# Altium schematic sheet P11_Exp Conn, uSD, and .SchDoc
size Legal
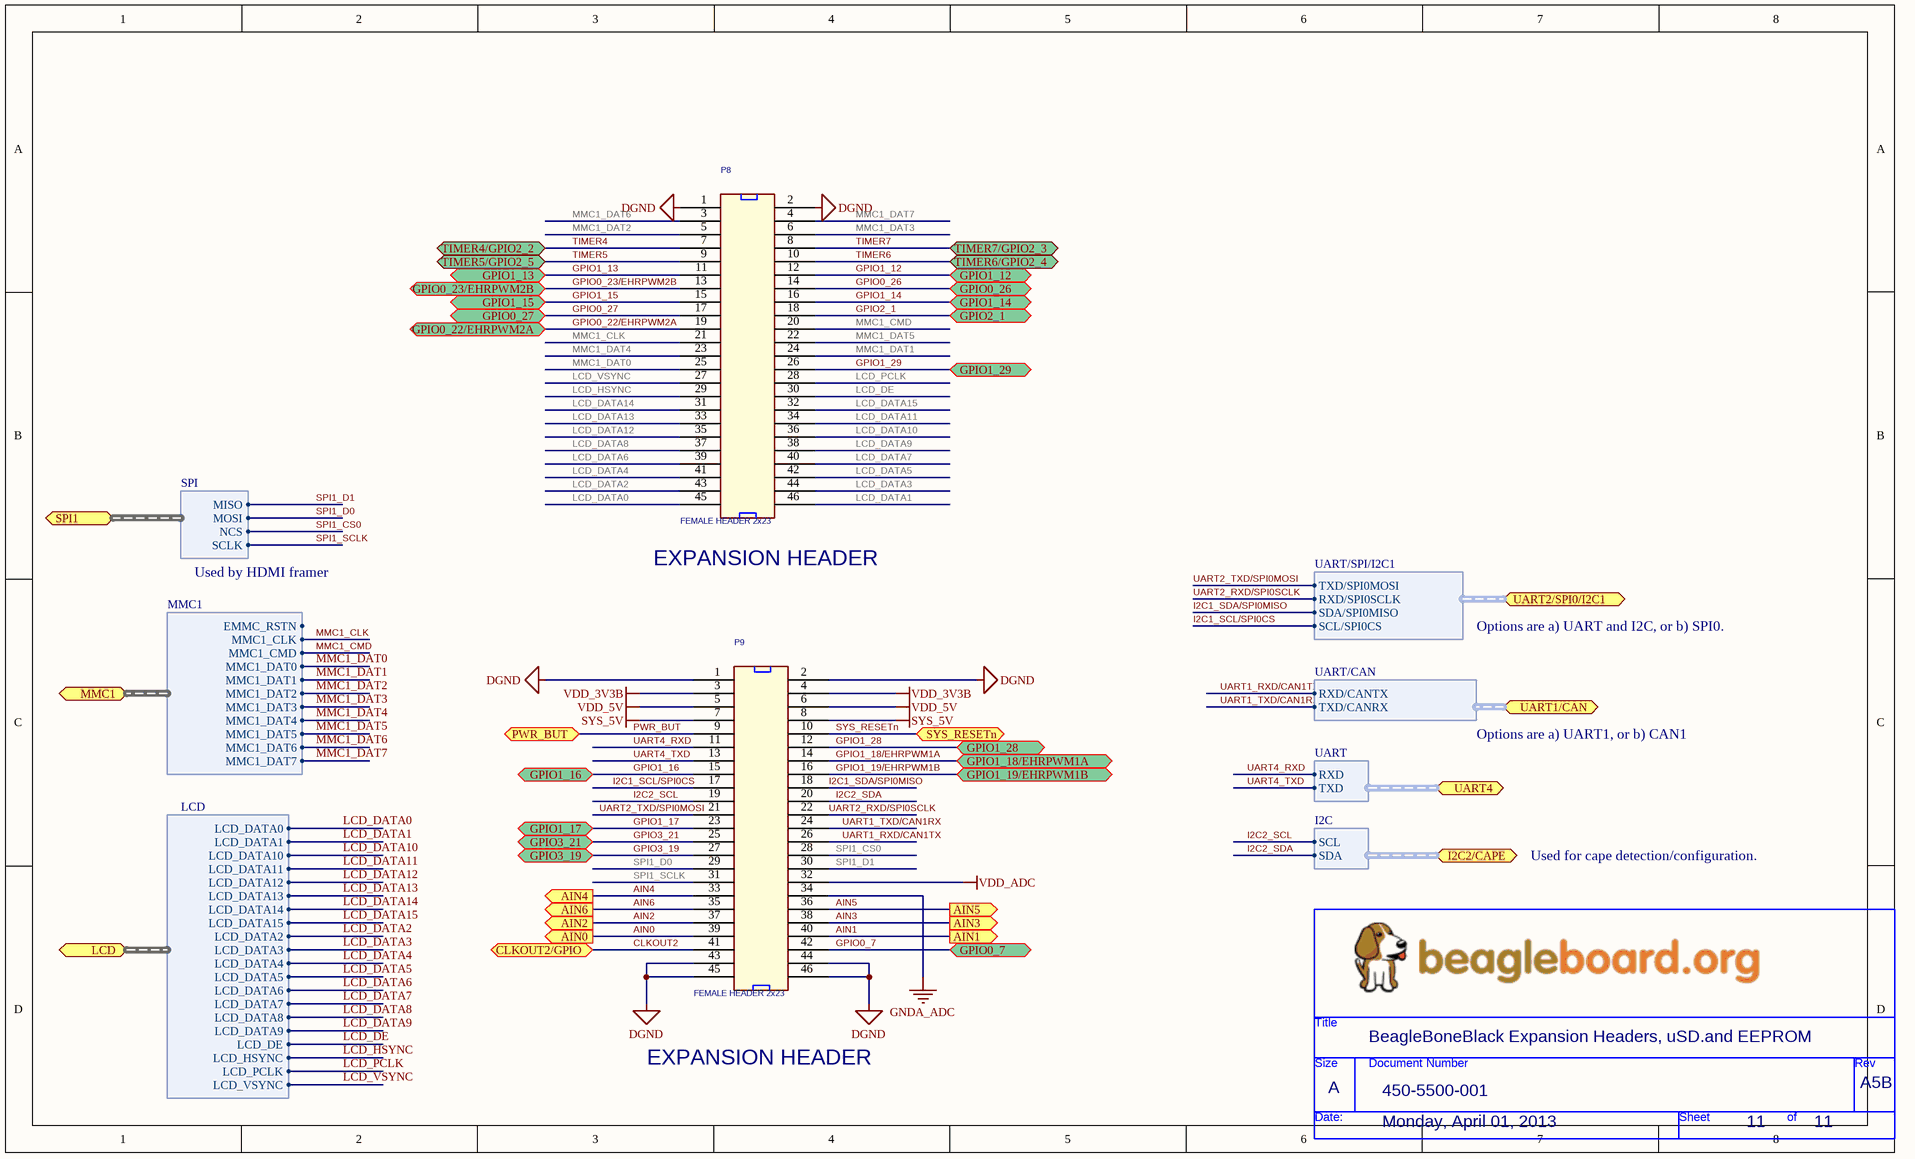
[diagram p0: P11_Exp Conn, uSD, and .SchDoc]

## Parts
*  Page Create Date: Monday, April 01, 2013  Doc: 450-5500-001  RevCode: A5B  Title: BeagleBoneBlack Expansion Headers, uSD.and EEPROM  Page Size: A  Page Number: 11  (hidden comment: BeagleBoard_org)  (graphical)
P8  FEMALE HEADER 2x23  [HEADER23X2]
P9  FEMALE HEADER 2x23  [HEADER23X2]

## Ports
AIN0 (out), AIN1 (out), AIN2 (out), AIN3 (out), AIN4 (out), AIN5 (out), AIN6 (out), CLKOUT2/GPIO, GPIO0_7, GPIO0_22/EHRPWM2A, GPIO0_23/EHRPWM2B, GPIO0_26, GPIO0_27, GPIO1_12, GPIO1_13, GPIO1_14, GPIO1_15, GPIO1_16, GPIO1_17, GPIO1_18/EHRPWM1A, GPIO1_19/EHRPWM1B, GPIO1_28, GPIO1_29, GPIO2_1, GPIO3_19, GPIO3_21, I2C2/CAPE (harness I2C), LCD (harness LCD), MMC1 (harness MMC1), PWR_BUT, SPI1 (harness SPI), SYS_RESETn, TIMER4/GPIO2_2 (bidir), TIMER5/GPIO2_5 (bidir), TIMER6/GPIO2_4 (bidir), TIMER7/GPIO2_3 (bidir), UART1/CAN (harness UART/CAN), UART2/SPI0/I2C1 (harness UART/SPI/I2C1), UART4 (harness UART)

## Harnesses
LCD: LCD_DATA0, LCD_DATA1, LCD_DATA10, LCD_DATA11, LCD_DATA12, LCD_DATA13, LCD_DATA14, LCD_DATA15, LCD_DATA2, LCD_DATA3, LCD_DATA4, LCD_DATA5, LCD_DATA6, LCD_DATA7, LCD_DATA8, LCD_DATA9, LCD_DE, LCD_HSYNC, LCD_PCLK, LCD_VSYNC
MMC1: EMMC_RSTN, MMC1_CLK, MMC1_CMD, MMC1_DAT0, MMC1_DAT1, MMC1_DAT2, MMC1_DAT3, MMC1_DAT4, MMC1_DAT5, MMC1_DAT6, MMC1_DAT7
UART: RXD, TXD
I2C: SCL, SDA
SPI: MISO, MOSI, NCS, SCLK
UART/CAN: RXD/CANTX, TXD/CANRX
UART/SPI/I2C1: RXD/SPI0SCLK, TXD/SPI0MOSI, SDA/SPI0MISO, SCL/SPI0CS

## Nets
DGND: P8.1 P8.2 P9.1 P9.2 P9.43 P9.44 P9.45 P9.46
GNDA_ADC: P9.34
SYS_5V: P9.7 P9.8
VDD_3V3B: P9.3 P9.4
VDD_5V: P9.5 P9.6
VDD_ADC: P9.32
AIN0: P9.39 ; port AIN0
AIN1: P9.40 ; port AIN1
AIN2: P9.37 ; port AIN2
AIN3: P9.38 ; port AIN3
AIN4: P9.33 ; port AIN4
AIN5: P9.36 ; port AIN5
AIN6: P9.35 ; port AIN6
CLKOUT2: P9.41 ; port CLKOUT2/GPIO
GPIO0_7: P9.42 ; port GPIO0_7
GPIO0_22/EHRPWM2A: P8.19 ; port GPIO0_22/EHRPWM2A
GPIO0_23/EHRPWM2B: P8.13 ; port GPIO0_23/EHRPWM2B
GPIO0_26: P8.14 ; port GPIO0_26
GPIO0_27: P8.17 ; port GPIO0_27
GPIO1_12: P8.12 ; port GPIO1_12
GPIO1_13: P8.11 ; port GPIO1_13
GPIO1_14: P8.16 ; port GPIO1_14
GPIO1_15: P8.15 ; port GPIO1_15
GPIO1_16: P9.15 ; port GPIO1_16
GPIO1_17: P9.23 ; port GPIO1_17
GPIO1_18/EHRPWM1A: P9.14 ; port GPIO1_18/EHRPWM1A
GPIO1_19/EHRPWM1B: P9.16 ; port GPIO1_19/EHRPWM1B
GPIO1_28: P9.12 ; port GPIO1_28
GPIO1_29: P8.26 ; port GPIO1_29
GPIO2_1: P8.18 ; port GPIO2_1
GPIO3_19: P9.27 ; port GPIO3_19
GPIO3_21: P9.25 ; port GPIO3_21
I2C1_SCL/SPI0CS: P9.17 ; port UART2/SPI0/I2C1.SCL/SPI0CS
I2C1_SDA/SPI0MISO: P9.18 ; port UART2/SPI0/I2C1.SDA/SPI0MISO
I2C2_SCL: P9.19 ; port I2C2/CAPE.SCL
I2C2_SDA: P9.20 ; port I2C2/CAPE.SDA
LCD_DATA0: P8.45 ; port LCD.LCD_DATA0
LCD_DATA1: P8.46 ; port LCD.LCD_DATA1
LCD_DATA2: P8.43 ; port LCD.LCD_DATA2
LCD_DATA3: P8.44 ; port LCD.LCD_DATA3
LCD_DATA4: P8.41 ; port LCD.LCD_DATA4
LCD_DATA5: P8.42 ; port LCD.LCD_DATA5
LCD_DATA6: P8.39 ; port LCD.LCD_DATA6
LCD_DATA7: P8.40 ; port LCD.LCD_DATA7
LCD_DATA8: P8.37 ; port LCD.LCD_DATA8
LCD_DATA9: P8.38 ; port LCD.LCD_DATA9
LCD_DATA10: P8.36 ; port LCD.LCD_DATA10
LCD_DATA11: P8.34 ; port LCD.LCD_DATA11
LCD_DATA12: P8.35 ; port LCD.LCD_DATA12
LCD_DATA13: P8.33 ; port LCD.LCD_DATA13
LCD_DATA14: P8.31 ; port LCD.LCD_DATA14
LCD_DATA15: P8.32 ; port LCD.LCD_DATA15
LCD_DE: P8.30 ; port LCD.LCD_DE
LCD_HSYNC: P8.29 ; port LCD.LCD_HSYNC
LCD_PCLK: P8.28 ; port LCD.LCD_PCLK
LCD_VSYNC: P8.27 ; port LCD.LCD_VSYNC
MMC1_CLK: P8.21 ; port MMC1.MMC1_CLK
MMC1_CMD: P8.20 ; port MMC1.MMC1_CMD
MMC1_DAT0: P8.25 ; port MMC1.MMC1_DAT0
MMC1_DAT1: P8.24 ; port MMC1.MMC1_DAT1
MMC1_DAT2: P8.5 ; port MMC1.MMC1_DAT2
MMC1_DAT3: P8.6 ; port MMC1.MMC1_DAT3
MMC1_DAT4: P8.23 ; port MMC1.MMC1_DAT4
MMC1_DAT5: P8.22 ; port MMC1.MMC1_DAT5
MMC1_DAT6: P8.3 ; port MMC1.MMC1_DAT6
MMC1_DAT7: P8.4 ; port MMC1.MMC1_DAT7
PWR_BUT: P9.9 ; port PWR_BUT
SPI1_CS0: P9.28 ; port SPI1.NCS
SPI1_D0: P9.29 ; port SPI1.MOSI
SPI1_D1: P9.30 ; port SPI1.MISO
SPI1_SCLK: P9.31 ; port SPI1.SCLK
SYS_RESETn: P9.10 ; port SYS_RESETn
TIMER4: P8.7 ; port TIMER4/GPIO2_2
TIMER5: P8.9 ; port TIMER5/GPIO2_5
TIMER6: P8.10 ; port TIMER6/GPIO2_4
TIMER7: P8.8 ; port TIMER7/GPIO2_3
UART1_RXD/CAN1TX: P9.26 ; port UART1/CAN.RXD/CANTX
UART1_TXD/CAN1RX: P9.24 ; port UART1/CAN.TXD/CANRX
UART2_RXD/SPI0SCLK: P9.22 ; port UART2/SPI0/I2C1.RXD/SPI0SCLK
UART2_TXD/SPI0MOSI: P9.21 ; port UART2/SPI0/I2C1.TXD/SPI0MOSI
UART4_RXD: P9.11 ; port UART4.RXD
UART4_TXD: P9.13 ; port UART4.TXD

## Notes on the sheet
- Used by HDMI framer
- (near P8) EXPANSION HEADER
- Options are a) UART and I2C, or b) SPI0.
- Options are a) UART1, or b) CAN1
- Used for cape detection/configuration.
- EXPANSION HEADER
- (in symbol BeagleBoard_org) Title; Size; Document Number; Rev; Date:; Sheet; of

## Library data of the parts
P8 P9 = HDR_46_F_2_0.1_0.1: CONN HEADER FMAL 46PS.1" DL GOLD; Manufacturer: Sullins Connector Solutions; Manufacturer Part Number: PPPC232LFBN-RC; Number of Positions: 46; Number of Positions Loaded: All; Pitch: 0.100" (2.54mm); Supplier 1: Digi-Key; Supplier Part Number 1: S7126-ND; RoHS: RoHS Compliant; Category: Connectors, Interconnects; Stock 1: 750; Pricing 1: 1=2.75, 10=2.325, 25=2.2196, 50=2.0084, 100=1.7969, 250=1.58552, 500=1.4798, 1000=1.3741, 2500=1.32125 (USD); Connector Type: Header; Contact Type: Female Socket; Number of Rows: 2; Row Spacing: 0.100" (2.54mm); Mounting Type: Through Hole; Termination: Solder; Fastening Type: -; Features: -; Contact Finish: Gold; Contact Finish Thickness: Flash; Color: Black; Packaging: Bulk; ComponentLink1URL: http://www.sullinscorp.com/drawings/78_P(N)PxCxxxLFBN-RC,_10492-G.pdf; ComponentLink1Description: http://www.sullinscorp.com/drawings/78_P(N)PxCxxxLFBN-RC,_10492-G.pdf
* = BeagleBoard_org: Page Count: 11